# Altium schematic sheet BRCM_V1.SchDoc
size A4
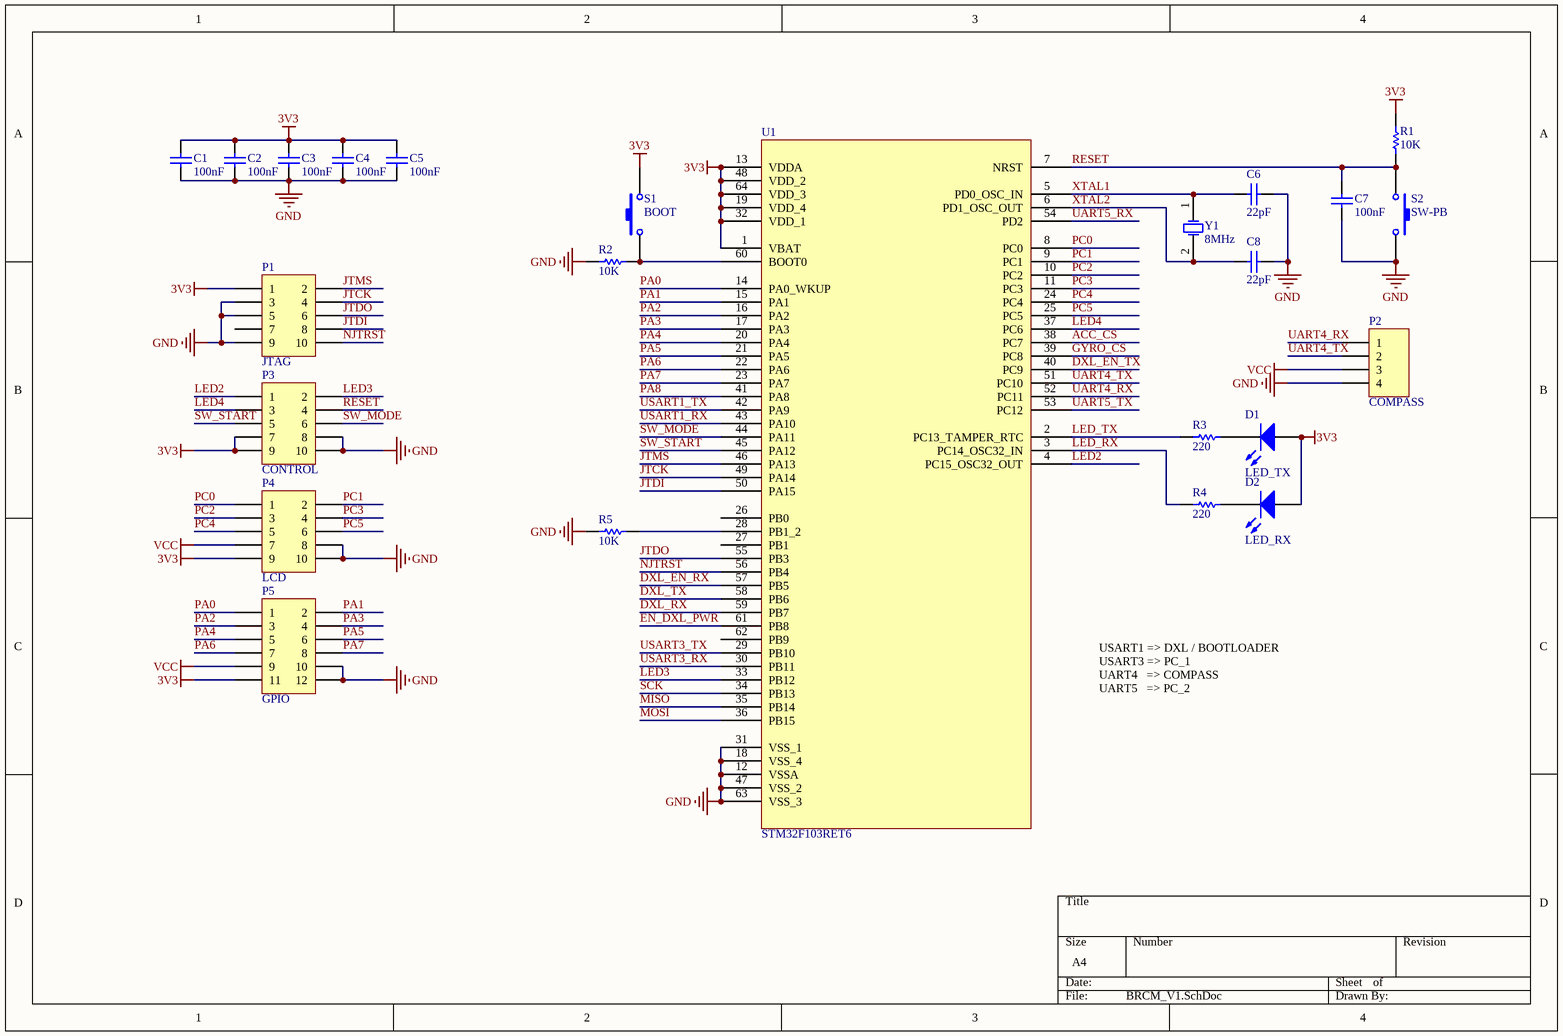
[diagram p0: BRCM_V1.SchDoc]

## Parts
C1  100nF  [0603-CAP]
C2  100nF  [0603-CAP]
C3  100nF  [0603-CAP]
C4  100nF  [0603-CAP]
C5  100nF  [0603-CAP]
C6  22pF  [0603-CAP]
C7  100nF  [0603-CAP]
C8  22pF  [0603-CAP]
D1  LED_TX  [CHIPLED_0603]
D2  LED_RX  [CHIPLED_0603]
P1  JTAG  [HDR2X5]
P2  COMPASS  [HDR1X4]
P3  CONTROL  [HDR2X5]
P4  LCD  [HDR2X5]
P5  GPIO  [HDR2X6]
R1  10K  [0603-RES]
R2  10K  [0603-RES]
R3  220  [0603-RES]
R4  220  [0603-RES]
R5  10K  [0603-RES]
S1  BOOT  [TACTILE-SWITCH-SMD]
S2  SW-PB  [TACTILE-SWITCH-SMD]
U1  STM32F103RET6  [QFP-64N]
Y1  8MHz  [HC49UP]

## Nets
3V3: C1.2 C2.2 C3.2 C4.2 C5.2 D1.1(A) D2.1(A) P1.1 P3.7 P3.9 P4.9 P5.11 R1.2 S1.3 U1.1(VBAT) U1.13(VDDA) U1.19(VDD_4) U1.32(VDD_1) U1.48(VDD_2) U1.64(VDD_3)
GND: C1.1 C2.1 C3.1 C4.1 C5.1 C6.1 C7.1 C8.1 P1.3 P1.5 P1.9 P2.4 P3.8 P3.10 P4.8 P4.10 P5.10 P5.12 R2.1 R5.1 S2.3 U1.12(VSSA) U1.18(VSS_4) U1.31(VSS_1) U1.47(VSS_2) U1.63(VSS_3)
VCC: P2.3 P4.7 P5.9
ACC_CS: U1.38(PC7)
DXL_EN_RX: U1.57(PB5)
DXL_EN_TX: U1.40(PC9)
DXL_RX: U1.59(PB7)
DXL_TX: U1.58(PB6)
EN_DXL_PWR: U1.61(PB8)
GYRO_CS: U1.39(PC8)
JTCK: P1.4 U1.49(PA14)
JTDI: P1.8 U1.50(PA15)
JTDO: P1.6 U1.55(PB3)
JTMS: P1.2 U1.46(PA13)
LED2: P3.1 U1.4(PC15_OSC32_OUT)
LED3: P3.2 U1.33(PB12)
LED4: P3.3 U1.37(PC6)
LED_RX: R4.1 U1.3(PC14_OSC32_IN)
LED_TX: R3.1 U1.2(PC13_TAMPER_RTC)
MISO: U1.35(PB14)
MOSI: U1.36(PB15)
NJTRST: P1.10 U1.56(PB4)
PA0: P5.1 U1.14(PA0_WKUP)
PA1: P5.2 U1.15(PA1)
PA2: P5.3 U1.16(PA2)
PA3: P5.4 U1.17(PA3)
PA4: P5.5 U1.20(PA4)
PA5: P5.6 U1.21(PA5)
PA6: P5.7 U1.22(PA6)
PA7: P5.8 U1.23(PA7)
PA8: U1.41(PA8)
PC0: P4.1 U1.8(PC0)
PC1: P4.2 U1.9(PC1)
PC2: P4.3 U1.10(PC2)
PC3: P4.4 U1.11(PC3)
PC4: P4.5 U1.24(PC4)
PC5: P4.6 U1.25(PC5)
RESET: C7.2 P3.4 R1.1 S2.1 U1.7(NRST)
SCK: U1.34(PB13)
SW_MODE: P3.6 U1.44(PA11)
SW_START: P3.5 U1.45(PA12)
UART4_RX: P2.1 U1.52(PC11)
UART4_TX: P2.2 U1.51(PC10)
UART5_RX: U1.54(PD2)
UART5_TX: U1.53(PC12)
USART1_RX: U1.43(PA10)
USART1_TX: U1.42(PA9)
USART3_RX: U1.30(PB11)
USART3_TX: U1.29(PB10)
XTAL1: C6.2 U1.5(PD0_OSC_IN) Y1.1(OSC1)
XTAL2: C8.2 U1.6(PD1_OSC_OUT) Y1.2(OSC2)
NetD1_2: D1.2(K) R3.2
NetD2_2: D2.2(K) R4.2
NetR2_2: R2.2 S1.1 U1.60(BOOT0)
NetR5_2: R5.2 U1.28(PB1_2)

Not connected (* = marked no-connect by the designer): P1 7; U1 26(PB0) 27(PB1) 62(PB9)

## Notes on the sheet
- USART1 => DXL / BOOTLOADER
  USART3 => PC_1
  UART4   => COMPASS
  UART5   => PC_2

## Library data of the parts
C1-C8 = Cap: Capacitor; Published: 8-Jun-2000; LatestRevisionDate: 17-Jul-2002; LatestRevisionNote: Re-released for DXP Platform.; PackageReference: RAD-0.3; Publisher: Altium Limited; PackageDescription: Radial Cap, Thru-Hole; 2 Leads; 0.3 in Pin Spacing
  C1-C5 C7: Value: 100nF
  C6 C8: Value: 22pF
D1 D2 = LED: Typical INFRARED GaAs LED; Published: 8-Jun-2000; LatestRevisionDate: 08-Jul-2005; LatestRevisionNote: Mech Layer 1 removed.; PackageReference: LED-0; Publisher: Altium Limited; PackageDescription: LED; 2 Leads
P1 P3 P4 = Header 5X2: Header, 5-Pin, Dual row; LatestRevisionDate: 17-Jul-2002; LatestRevisionNote: Re-released for DXP Platform.; Publisher: Altium Limited
P2 = Header 4: Header, 4-Pin; LatestRevisionDate: 17-Jul-2002; LatestRevisionNote: Re-released for DXP Platform.; Publisher: Altium Limited
P5 = Header 6X2: Header, 6-Pin, Dual row; LatestRevisionDate: 17-Jul-2002; LatestRevisionNote: Re-released for DXP Platform.; Publisher: Altium Limited
R1-R5 = Res: Resistor; Published: 8-Jun-2000; LatestRevisionDate: 17-Jul-2002; LatestRevisionNote: Re-released for DXP Platform.; PackageReference: AXIAL-0.3; Publisher: Altium Limited; PackageDescription: Axial Device, Thru-Hole; 2 Leads; 0.3 in Pin Spacing
  R1 R2 R5: Value: 10K
  R3 R4: Value: 220
S1 S2 = SW-PB: Switch; Published: 24-Mar-1999; LatestRevisionDate: 17-Jul-2002; LatestRevisionNote: Re-released for DXP Platform.; PackageReference: SPST-2; Publisher: Altium Limited; PackageDescription: Switch; 2 Leads
Y1 = XTAL: Crystal Oscillator; Published: 8-Jun-2000; LatestRevisionDate: 17-Jul-2002; LatestRevisionNote: Re-released for DXP Platform.; PackageReference: R38; Publisher: Altium Limited; PackageDescription: Crystal, Thru-Hole; 2 Leads; Body 3.1 x 8.2 mm (Dia.xH)
U1 = STM32F103RET6: MPN: STM32F103RET6; OC_FARNELL: 1624138; OC_NEWARK: 01P4101; PACKAGE: QFP-64; SUPPLIER: STMICROELECTRONICS